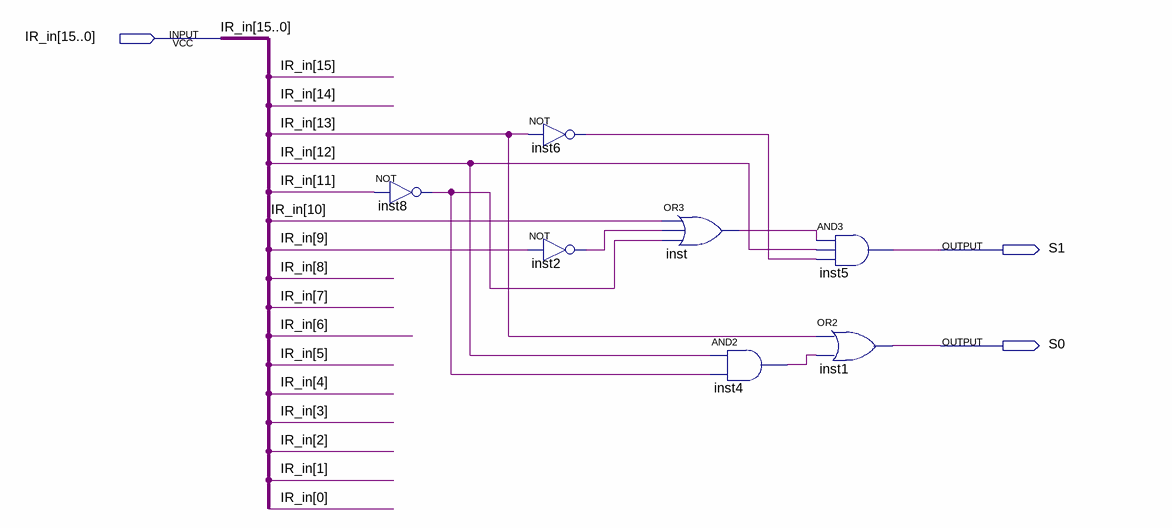
[diagram p0: schematic sheet]
// Quartus schematic Ex0_Select.bdf as structural Verilog: 7 symbols, 3 pins
module Ex0_Select (
  input  [15:0] IR_in,
  output S1,
  output S0
);

  wire inst2_out, inst4_out, inst6_out, inst8_out, inst_out;

  not inst8 (inst8_out, IR_in[11]);
  not inst6 (inst6_out, IR_in[13]);
  not inst2 (inst2_out, IR_in[9]);
  or inst (inst_out, IR_in[10], inst2_out, inst8_out);
  and inst4 (inst4_out, IR_in[12], inst8_out);
  and inst5 (S1, inst_out, IR_in[12], inst6_out);
  or inst1 (S0, IR_in[13], inst4_out);
endmodule
